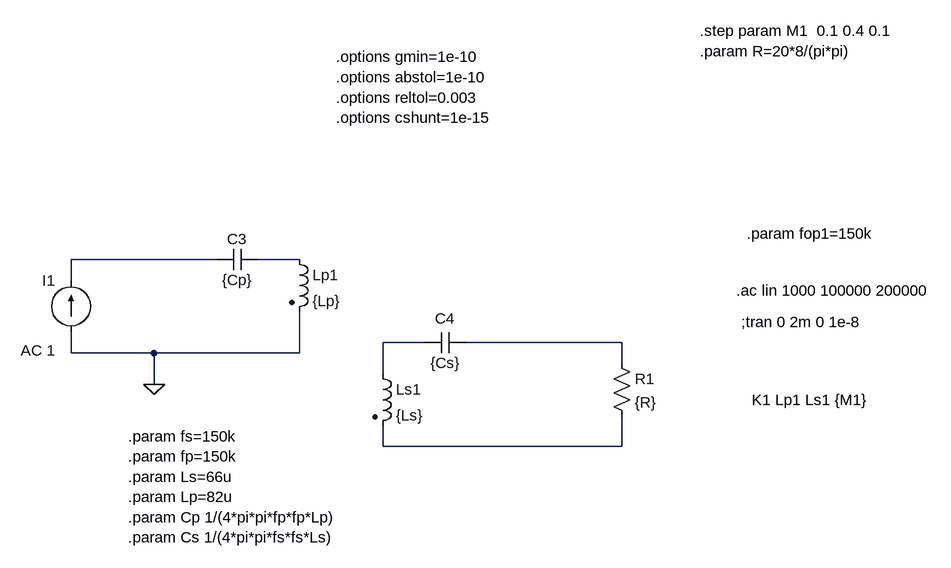
[diagram p0: schematic 1P1S_current_source.asc]
1P1S_current_source.asc, the LTspice schematic file:
Version 4
SHEET 1 3864 3572
WIRE 1072 480 848 480
WIRE 1200 480 1136 480
WIRE 848 512 848 480
WIRE 1392 608 1328 608
WIRE 1696 608 1456 608
WIRE 848 624 848 592
WIRE 976 624 848 624
WIRE 1200 624 1200 560
WIRE 1200 624 976 624
WIRE 1696 640 1696 608
WIRE 1328 656 1328 608
WIRE 976 672 976 624
WIRE 1328 768 1328 736
WIRE 1696 768 1696 720
WIRE 1696 768 1328 768
FLAG 976 672 0
SYMBOL ind2 1184 464 R0
SYMATTR InstName Lp1
SYMATTR Value {Lp}
SYMATTR Type ind
SYMBOL cap 1136 464 R90
WINDOW 0 0 32 VBottom 2
WINDOW 3 32 32 VTop 2
SYMATTR InstName C3
SYMATTR Value {Cp}
SYMBOL ind2 1312 640 R0
SYMATTR InstName Ls1
SYMATTR Value {Ls}
SYMATTR Type ind
SYMBOL cap 1456 592 R90
WINDOW 0 -6 32 VBottom 2
WINDOW 3 32 32 VTop 2
SYMATTR InstName C4
SYMATTR Value {Cs}
SYMBOL res 1680 624 R0
SYMATTR InstName R1
SYMATTR Value {R}
SYMBOL current 848 592 R180
WINDOW 0 24 80 Left 2
WINDOW 3 24 0 Left 2
WINDOW 123 24 -28 Left 2
WINDOW 39 0 0 Left 0
SYMATTR InstName I1
SYMATTR Value ""
SYMATTR Value2 AC 1
TEXT 1880 576 Left 2 !;tran 0 2m 0 1e-8
TEXT 936 752 Left 2 !.param fs=150k\n.param fp=150k\n.param Ls=66u\n.param Lp=82u\n.param Cp 1/(4*pi*pi*fp*fp*Lp)\n.param Cs 1/(4*pi*pi*fs*fs*Ls)
TEXT 1872 528 Left 2 !.ac lin 1000 100000 200000
TEXT 1888 440 Left 2 !.param fop1=150k
TEXT 1256 168 Left 2 !.options gmin=1e-10   \n.options abstol=1e-10  \n.options reltol=0.003  \n.options cshunt=1e-15
TEXT 1896 696 Left 2 !K1 Lp1 Ls1 {M1}
TEXT 1816 128 Left 2 !.step param M1  0.1 0.4 0.1 \n.param R=20*8/(pi*pi)

The netlist it stands for:
* 1P1S_current_source.asc
Lp1 N002 0 {Lp}
C3 N002 N001 {Cp}
Ls1 N003 N005 {Ls}
C4 N004 N003 {Cs}
R1 N004 N005 {R}
I1 0 N001 AC 1
;tran 0 2m 0 1e-8
.param fs=150k
.param fp=150k
.param Ls=66u
.param Lp=82u
.param Cp 1/(4*pi*pi*fp*fp*Lp)
.param Cs 1/(4*pi*pi*fs*fs*Ls)
.ac lin 1000 100000 200000
.param fop1=150k
.options gmin=1e-10
.options abstol=1e-10
.options reltol=0.003
.options cshunt=1e-15
K1 Lp1 Ls1 {M1}
.step param M1  0.1 0.4 0.1
.param R=20*8/(pi*pi)
.backanno
.end